# Altium project sensor_hub_project.PrjPCB
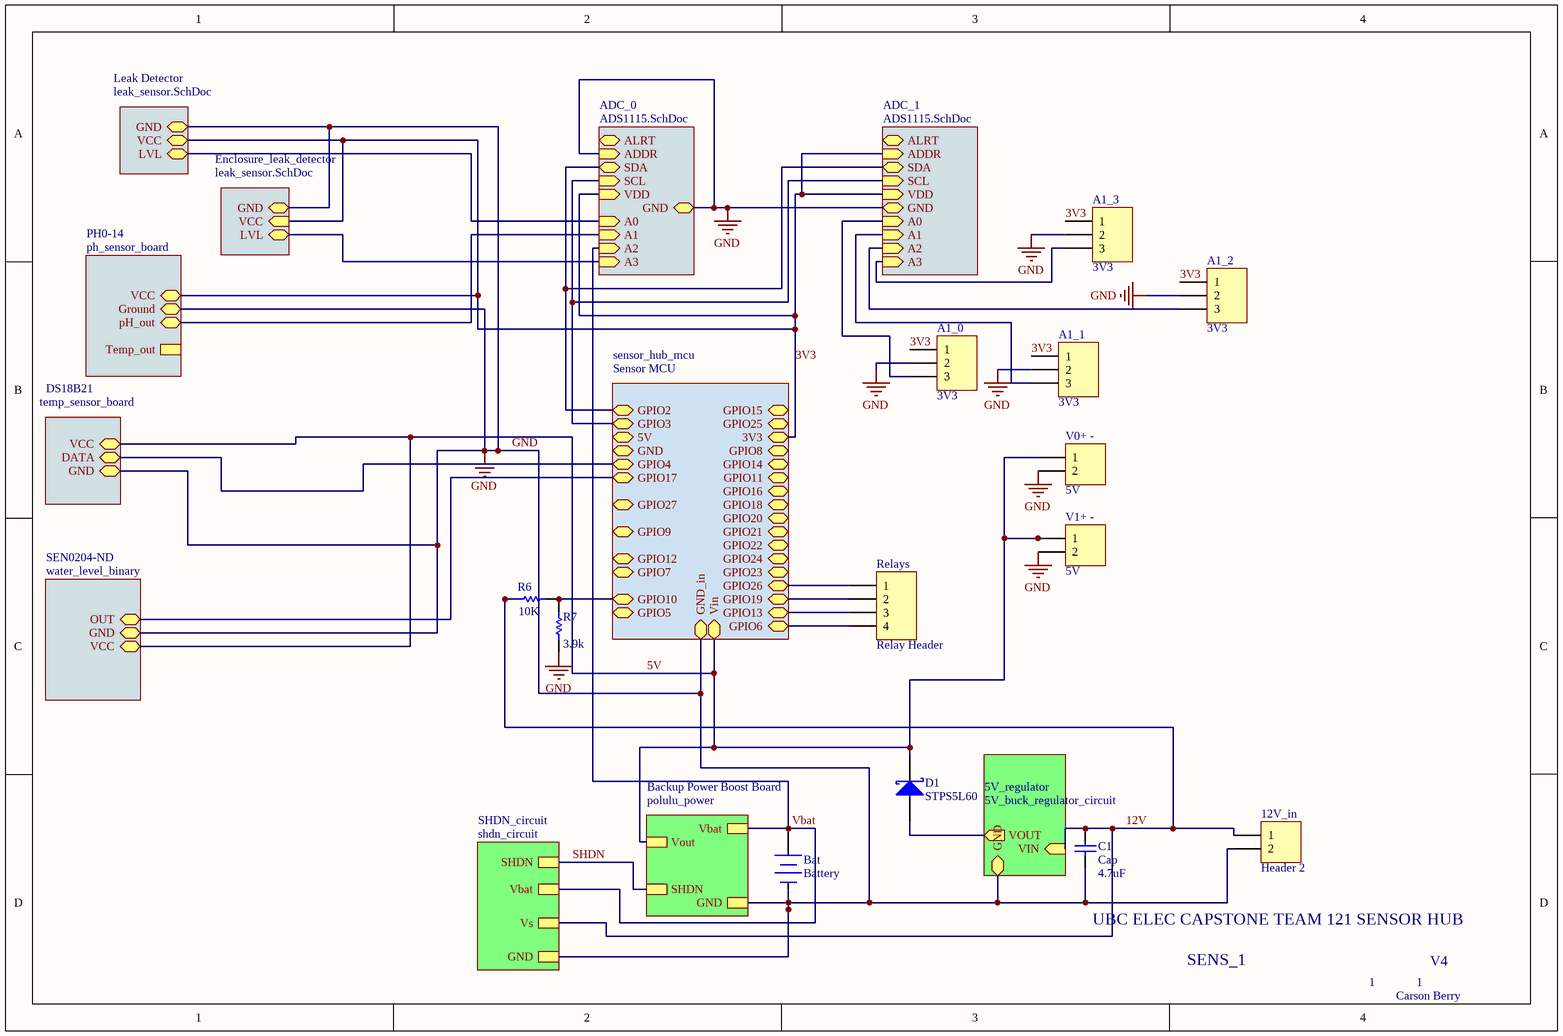
[diagram p0: water_quality_sensor_hub.SchDoc]
9 sheets, 30 parts. Net scope: hierarchical (ports join the sheet entries above them; power ports are global).
Board file: piponic_pcb_v2.PcbDoc
Sheets:
  water_quality_sensor_hub.SchDoc
    PH0-14 = ph_sensor_board.SchDoc
    DS18B21 = temp_sensor_board.SchDoc
    Sensor MCU = sensor_hub_mcu.SchDoc
    SEN0204-ND = water_level_binary.SchDoc
    Leak Detector = leak_sensor.SchDoc
    ADC_0 = ADS1115.SchDoc
    Backup Power Boost Board = polulu_power.SchDoc
    SHDN_circuit = shdn_circuit.SchDoc
    ADC_1 = ADS1115.SchDoc
    Enclosure_leak_detector = leak_sensor.SchDoc

## Sheet water_quality_sensor_hub.SchDoc
size A4

### Parts
12V_in  Header 2  [2_channel_terminal_block]
A1_0  3V3  [3_channel_terminal_block]
A1_1  3V3  [3_channel_terminal_block]
A1_2  3V3  [3_channel_terminal_block]
A1_3  3V3  [3_channel_terminal_block]
Bat  Battery  [BAT-2]
C1  Cap  value 4.7uF  [RAD-0.3]
D1  STPS5L60  [STM-DO-201AD]
R6  value 10K  [AXIAL-0.3]  (hidden comment: Res1)
R7  value 3.9k  [AXIAL-0.3]  (hidden comment: Res1)
Relays  Relay Header  [4_channel_terminal_block]
V0+_-  5V  [2_channel_terminal_block]
V1+_-  5V  [2_channel_terminal_block]

### Sub-sheets
5V_regulator = 5V_buck_regulator_circuit (file not in this document): VOUT (out), GND (bidir), VIN (in)
ADC_0 = ADS1115.SchDoc: A2 (in), ALRT (bidir), ADDR (in), SDA (bidir), SCL (in), A3 (in), GND (bidir), A0 (in), A1 (in), VDD (in)
ADC_1 = ADS1115.SchDoc: A2 (in), ALRT (bidir), ADDR (in), SDA (bidir), SCL (in), A3 (in), GND (bidir), A0 (in), A1 (in), VDD (in)
Backup Power Boost Board = polulu_power: SHDN, Vbat, Vout, GND
DS18B21 = temp_sensor_board: VCC (bidir), DATA (bidir), GND (bidir)
Enclosure_leak_detector = leak_sensor.SchDoc: GND (bidir), VCC (in), LVL (bidir)
Leak Detector = leak_sensor.SchDoc: GND (bidir), VCC (bidir), LVL (bidir)
PH0-14 = ph_sensor_board: VCC (bidir), Ground (bidir), pH_out (bidir), Temp_out
SEN0204-ND = water_level_binary: OUT (bidir), GND (bidir), VCC (bidir)
Sensor MCU = sensor_hub_mcu: GPIO2 (bidir), GPIO3 (bidir), GND (bidir), GPIO15 (bidir), GPIO17 (bidir), GPIO10 (bidir), GPIO8 (bidir), GPIO14 (bidir), GPIO11 (bidir), GPIO16 (bidir), GPIO18 (bidir), GPIO20 (bidir), GPIO21 (bidir), GPIO22 (bidir), GPIO24 (bidir), GPIO23 (bidir), GPIO25 (bidir), GPIO26 (bidir), 5V (bidir), GPIO19 (bidir), GPIO9 (bidir), GPIO13 (bidir), GPIO12 (bidir), GPIO7 (bidir), GPIO6 (bidir), GPIO4 (bidir), GPIO5 (bidir), 3V3 (bidir), GPIO27 (bidir), Vin (bidir), GND_in (bidir)
SHDN_circuit = shdn_circuit: GND, Vbat, Vs, SHDN

### Nets
GND: 12V_in.2 A1_0.2 A1_1.2 A1_2.2 A1_3.2 Bat.2(-) C1.1 R7.1 V0+_-.2 V1+_-.2 ; sheet PH0-14/Ground, sheet DS18B21/GND, sheet Sensor MCU/GND, sheet Sensor MCU/GND_in, sheet SEN0204-ND/GND, sheet Leak Detector/GND, sheet ADC_0/ADDR, sheet ADC_0/GND, sheet 5V_regulator/GND, sheet Backup Power Boost Board/GND, sheet SHDN_circuit/GND, sheet ADC_1/GND, sheet Enclosure_leak_detector/GND
3V3: A1_0.1 A1_1.1 A1_2.1 A1_3.1 ; sheet PH0-14/VCC, sheet Sensor MCU/3V3, sheet Leak Detector/VCC, sheet ADC_0/VDD, sheet ADC_1/ADDR, sheet ADC_1/VDD, sheet Enclosure_leak_detector/VCC
5V: D1.1(K) V0+_-.1 V1+_-.1 ; sheet DS18B21/VCC, sheet Sensor MCU/Vin, sheet SEN0204-ND/VCC, sheet Backup Power Boost Board/Vout
12V: 12V_in.1 C1.2 R6.1 ; sheet 5V_regulator/VIN, sheet SHDN_circuit/Vs
SHDN: sheet Backup Power Boost Board/SHDN, sheet SHDN_circuit/SHDN
Vbat: Bat.1(+) ; sheet ADC_0/A2, sheet Backup Power Boost Board/Vbat, sheet SHDN_circuit/Vbat
NetA1_0_3: A1_0.3 ; sheet ADC_1/A0
NetA1_1_3: A1_1.3 ; sheet ADC_1/A1
NetA1_2_3: A1_2.3 ; sheet ADC_1/A2
NetA1_3_3: A1_3.3 ; sheet ADC_1/A3
NetADC_0_3: sheet Sensor MCU/GPIO3, sheet ADC_0/SCL, sheet ADC_1/SCL
NetADC_0_4: sheet Sensor MCU/GPIO2, sheet ADC_0/SDA, sheet ADC_1/SDA
NetADC_0_7: sheet Leak Detector/LVL, sheet ADC_0/A0
NetADC_0_8: sheet PH0-14/pH_out, sheet ADC_0/A1
NetADC_0_10: sheet ADC_0/A3, sheet Enclosure_leak_detector/LVL
NetD1_2: D1.2(A) ; sheet 5V_regulator/VOUT
NetP12_7: sheet DS18B21/DATA, sheet Sensor MCU/GPIO4
NetP12_11: sheet Sensor MCU/GPIO17, sheet SEN0204-ND/OUT
NetP12_21: R6.2 R7.2 ; sheet Sensor MCU/GPIO10
NetP12_31: Relays.4 ; sheet Sensor MCU/GPIO6
NetP12_33: Relays.3 ; sheet Sensor MCU/GPIO13
NetP12_35: Relays.2 ; sheet Sensor MCU/GPIO19
NetP12_37: Relays.1 ; sheet Sensor MCU/GPIO26

### Notes on the sheet
- UBC ELEC CAPSTONE TEAM 121 SENSOR HUB
- SENS_1
- 1
- V4
- Carson Berry

### Library data of the parts
12V_in = Header 2: Power 12V in; LatestRevisionDate: 17-Jul-2002; LatestRevisionNote: Re-released for DXP Platform.; Publisher: Altium Limited
A1_0-A1_3 = Header 3: Header, 3-Pin; LatestRevisionDate: 17-Jul-2002; LatestRevisionNote: Re-released for DXP Platform.; Publisher: Altium Limited
Bat = Battery: 2AA batteries; Published: 24-Mar-1999; LatestRevisionDate: 17-Jul-2002; LatestRevisionNote: Re-released for DXP Platform.; PackageReference: BAT-2; Publisher: Altium Limited; PackageDescription: Battery; 2 Leads
C1 = Cap: Capacitor; Published: 8-Jun-2000; LatestRevisionDate: 17-Jul-2002; LatestRevisionNote: Re-released for DXP Platform.; PackageReference: RAD-0.3; Publisher: Altium Limited; PackageDescription: Radial Cap, Thru-Hole; 2 Leads; 0.3 in Pin Spacing
D1 = CMP-2000-05365-1: Power Schottky rectifier, 60 V, 5 A, 2-Pin DO-201AD, RoHS, Cut Tape; Manufacturer: STMicroelectronics; Other Related Documents: STPS5L60ViewAllSpecifications; Online Catalog: SchottkyDiode; Current - Average Rectified (Io): 5A; Speed: FastRecovery=200mA(Io); Current - Reverse Leakage @ Vr: 220µA@60V; Other Names: 497-12673-3STPS5L60-ND; Voltage - DC Reverse (Vr) (Max): 60V; Voltage - Forward (Vf) (Max) @ If: 520mV@5A; Package Description: 2-Pin Axial Lead, Dia 5.3 mm, Body Length 9.5 mm; Datasheet Version: Rev. 3, 05/2008; Datasheet URL: http://download.siliconexpert.com/pdfs/2012/8/10/13/5/5/781/st_/manual/cd00002924.pdf; Operating Temperature - Junction: 150degC(Max); Capacitance @ Vr, F: -; Manufacturer URL: http://www.st.com/; Standard Package: 600; Diode Type: Schottky; Package Reference: DO-201AD; Category: DiscreteSemiconductorProducts; Package / Case: DO-201AD,Axial; Family: Diodes,Rectifiers-Single; Packaging: Tape&Box(TB); Supplier Device Package: DO-201AD; Reverse Recovery Time (trr): -; Package URL: http://download.siliconexpert.com/pdfs/2012/8/10/13/5/5/781/st_/manual/cd00002924.pdf; Mounting Type: ThroughHole; Series: -
R6 R7 = Res1: Resistor; Published: 8-Jun-2000; LatestRevisionDate: 17-Jul-2002; LatestRevisionNote: Re-released for DXP Platform.; PackageReference: AXIAL-0.3; Publisher: Altium Limited; PackageDescription: Axial Device, Thru-Hole; 2 Leads; 0.3 in Pin Spacing
Relays = Header 4: Relay Control; LatestRevisionDate: 17-Jul-2002; LatestRevisionNote: Re-released for DXP Platform.; Publisher: Altium Limited
V0+_- V1+_- = Header 2: Header, 2-Pin; LatestRevisionDate: 17-Jul-2002; LatestRevisionNote: Re-released for DXP Platform.; Publisher: Altium Limited

## Sheet ph_sensor_board.SchDoc
size A4
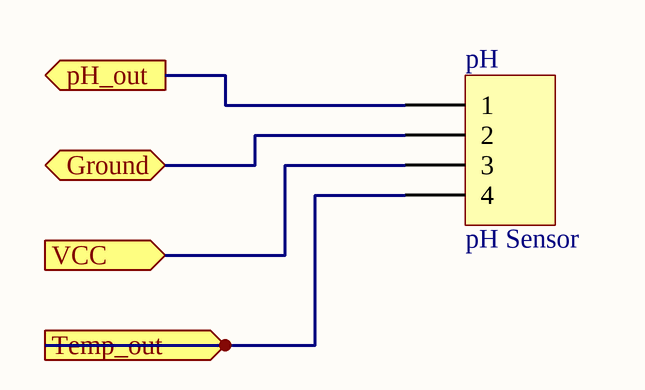
[diagram p1: ph_sensor_board.SchDoc]

### Parts
pH  pH Sensor  [4_channel_terminal_block]

### Ports
Ground (bidir), pH_out (out), Temp_out (out), VCC (in)

### Nets
GND: pH.2 ; port Ground
3V3: pH.3 ; port VCC
NetADC_0_8: pH.1 ; port pH_out
NetpH_4: pH.4 ; port Temp_out

### Library data of the parts
pH = Header 4: Header, 4-Pin; LatestRevisionDate: 17-Jul-2002; LatestRevisionNote: Re-released for DXP Platform.; Publisher: Altium Limited

## Sheet temp_sensor_board.SchDoc
size A4
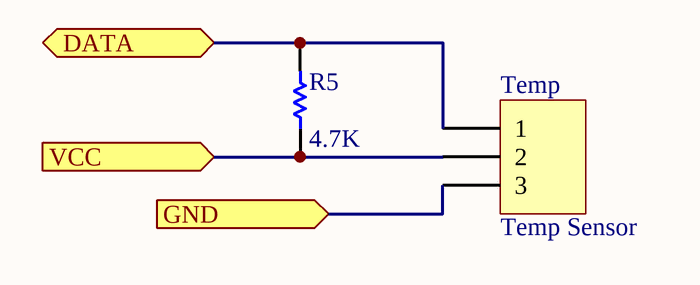
[diagram p2: temp_sensor_board.SchDoc]

### Parts
R5  value 4.7K  [AXIAL-0.3]
Temp  Temp Sensor  [HDR1X3]

### Ports
DATA (bidir), GND (in), VCC (in)

### Nets
GND: Temp.3 ; port GND
5V: R5.1 Temp.2 ; port VCC
NetP12_7: R5.2 Temp.1 ; port DATA

### Library data of the parts
R5 = Res1: Pull up; Published: 8-Jun-2000; LatestRevisionDate: 17-Jul-2002; LatestRevisionNote: Re-released for DXP Platform.; PackageReference: AXIAL-0.3; Publisher: Altium Limited; PackageDescription: Axial Device, Thru-Hole; 2 Leads; 0.3 in Pin Spacing
Temp = Header 3: Header, 3-Pin; LatestRevisionDate: 17-Jul-2002; LatestRevisionNote: Re-released for DXP Platform.; Publisher: Altium Limited

## Sheet sensor_hub_mcu.SchDoc
size A4
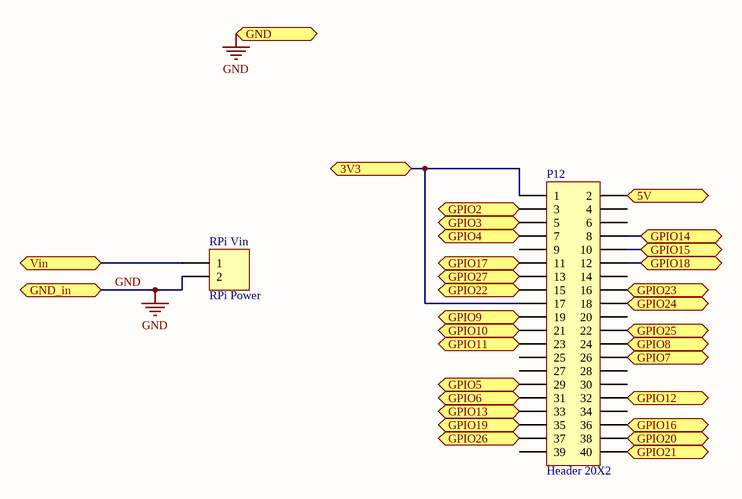
[diagram p3: sensor_hub_mcu.SchDoc]

### Parts
P12  Header 20X2  [HDR2X20]
RPi_Vin  RPi Power  [HDR1X2]

### Ports
3V3 (bidir), 5V (bidir), GND (bidir), GND_in (bidir), GPIO2 (bidir), GPIO3 (bidir), GPIO4 (bidir), GPIO5 (bidir), GPIO6 (bidir), GPIO7 (bidir), GPIO8 (bidir), GPIO9 (bidir), GPIO10 (bidir), GPIO11 (bidir), GPIO12 (bidir), GPIO13 (bidir), GPIO14 (bidir), GPIO15 (bidir), GPIO16 (bidir), GPIO17 (bidir), GPIO18 (bidir), GPIO19 (bidir), GPIO20 (bidir), GPIO21 (bidir), GPIO22 (bidir), GPIO23 (bidir), GPIO24 (bidir), GPIO25 (bidir), GPIO26 (bidir), GPIO27 (bidir), Vin (bidir)

### Nets
GND: RPi_Vin.2 ; port GND, port GND_in
3V3: P12.1 P12.17 ; port 3V3
5V: RPi_Vin.1 ; port Vin
NetADC_0_3: P12.5 ; port GPIO3
NetADC_0_4: P12.3 ; port GPIO2
NetP12_2: P12.2 ; port 5V
NetP12_7: P12.7 ; port GPIO4
NetP12_8: P12.8 ; port GPIO14
NetP12_10: P12.10 ; port GPIO15
NetP12_11: P12.11 ; port GPIO17
NetP12_12: P12.12 ; port GPIO18
NetP12_13: P12.13 ; port GPIO27
NetP12_15: P12.15 ; port GPIO22
NetP12_16: P12.16 ; port GPIO23
NetP12_18: P12.18 ; port GPIO24
NetP12_19: P12.19 ; port GPIO9
NetP12_21: P12.21 ; port GPIO10
NetP12_22: P12.22 ; port GPIO25
NetP12_23: P12.23 ; port GPIO11
NetP12_24: P12.24 ; port GPIO8
NetP12_26: P12.26 ; port GPIO7
NetP12_29: P12.29 ; port GPIO5
NetP12_31: P12.31 ; port GPIO6
NetP12_32: P12.32 ; port GPIO12
NetP12_33: P12.33 ; port GPIO13
NetP12_35: P12.35 ; port GPIO19
NetP12_36: P12.36 ; port GPIO16
NetP12_37: P12.37 ; port GPIO26
NetP12_38: P12.38 ; port GPIO20
NetP12_40: P12.40 ; port GPIO21

Not connected (* = marked no-connect by the designer): P12 4 6 9 14 20 25 27 28 30 34 39

### Library data of the parts
P12 = Header 20X2: GPIO shield for RPi; LatestRevisionDate: 17-Jul-2002; LatestRevisionNote: Re-released for DXP Platform.; Publisher: Altium Limited
RPi_Vin = Header 2: Power Pins; LatestRevisionDate: 17-Jul-2002; LatestRevisionNote: Re-released for DXP Platform.; Publisher: Altium Limited

## Sheet water_level_binary.SchDoc
size A4
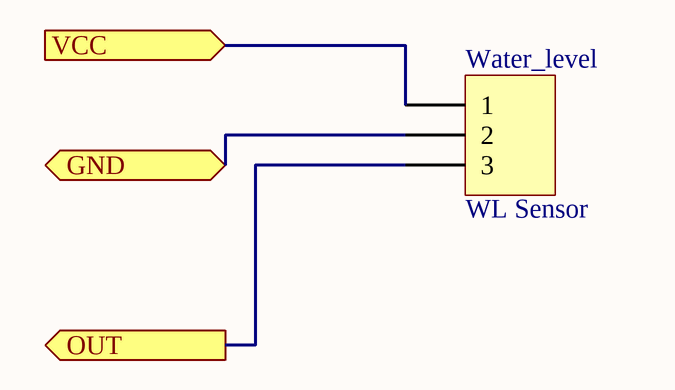
[diagram p4: water_level_binary.SchDoc]

### Parts
Water_level  WL Sensor  [3_channel_terminal_block]

### Ports
GND (bidir), OUT (out), VCC (in)

### Nets
GND: Water_level.2 ; port GND
5V: Water_level.1 ; port VCC
NetP12_11: Water_level.3 ; port OUT

### Library data of the parts
Water_level = Header 3: Header, 3-Pin; LatestRevisionDate: 17-Jul-2002; LatestRevisionNote: Re-released for DXP Platform.; Publisher: Altium Limited

## Sheet leak_sensor.SchDoc
size A4
Used 2 times, as channels Leak Detector, Enclosure_leak_detector. Parts and nets are listed once, with the designators drawn on the sheet.
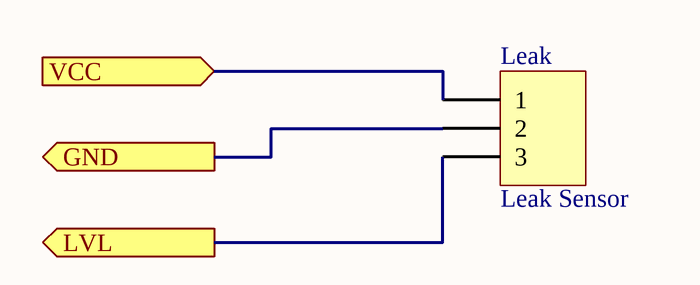
[diagram p5: leak_sensor.SchDoc]

### Parts
Leak  Leak Sensor  [3_channel_terminal_block]

### Ports
GND (out), LVL (out), VCC (in)

### Nets
GND: Leak.2 ; port GND
LVL: Leak.3 ; port LVL
VCC: Leak.1 ; port VCC

### Channels
Leak Detector: ports GND=GND LVL=NetADC_0_7 VCC=3V3
Enclosure_leak_detector: designators Leak=Encl_leak; ports GND=GND LVL=NetADC_0_10 VCC=3V3

### Library data of the parts
Leak = Header 3: Header, 3-Pin; LatestRevisionDate: 17-Jul-2002; LatestRevisionNote: Re-released for DXP Platform.; Publisher: Altium Limited

## Sheet ADS1115.SchDoc
size A4
Used 2 times, as channels ADC_0, ADC_1. Parts and nets are listed once, with the designators drawn on the sheet.
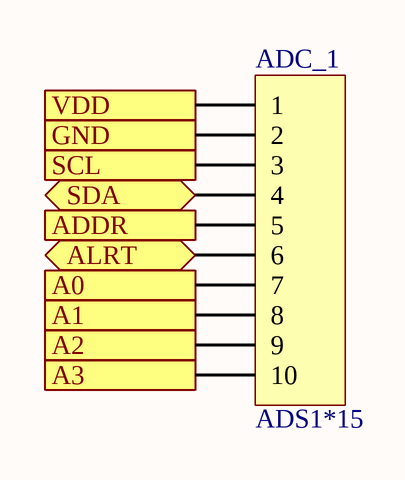
[diagram p6: ADS1115.SchDoc]

### Parts
ADC_1  ADS1*15  [HDR1X10]

### Ports
A0 (in), A1 (in), A2 (in), A3 (in), ADDR (in), ALRT (bidir), GND (out), SCL (in), SDA (bidir), VDD (in)

### Nets
A0: ADC_1.7 ; port A0
A1: ADC_1.8 ; port A1
A2: ADC_1.9 ; port A2
A3: ADC_1.10 ; port A3
ADDR: ADC_1.5 ; port ADDR
ALRT: ADC_1.6 ; port ALRT
GND: ADC_1.2 ; port GND
SCL: ADC_1.3 ; port SCL
SDA: ADC_1.4 ; port SDA
VDD: ADC_1.1 ; port VDD

### Channels
ADC_0: designators ADC_1=ADC_0; ports A0=NetADC_0_7 A1=NetADC_0_8 A2=Vbat A3=NetADC_0_10 ADDR=GND ALRT=NetADC_0_6 GND=GND SCL=NetADC_0_3 SDA=NetADC_0_4 VDD=3V3
ADC_1: ports A0=NetA1_0_3 A1=NetA1_1_3 A2=NetA1_2_3 A3=NetA1_3_3 ADDR=3V3 ALRT=NetADC_1_6 GND=GND SCL=NetADC_0_3 SDA=NetADC_0_4 VDD=3V3

### Library data of the parts
ADC_1 = Header 10: Header, 10-Pin; LatestRevisionDate: 17-Jul-2002; LatestRevisionNote: Re-released for DXP Platform.; Publisher: Altium Limited

## Sheet polulu_power.SchDoc
size A4
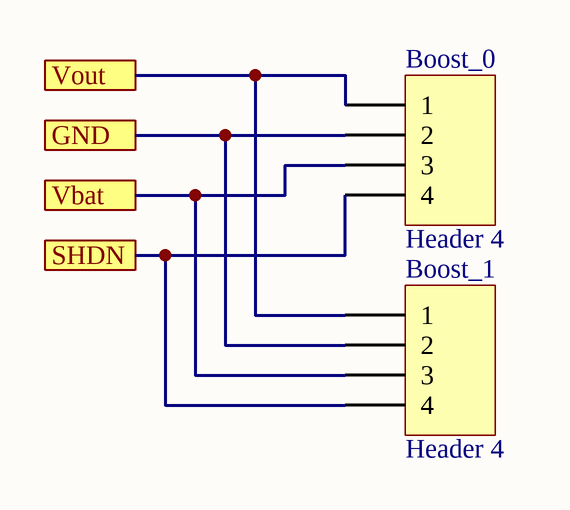
[diagram p7: polulu_power.SchDoc]

### Parts
Boost_0  Header 4  [HDR1X4]
Boost_1  Header 4  [HDR1X4]

### Ports
GND, SHDN, Vbat, Vout

### Nets
GND: Boost_0.2 Boost_1.2 ; port GND
5V: Boost_0.1 Boost_1.1 ; port Vout
SHDN: Boost_0.4 Boost_1.4 ; port SHDN
Vbat: Boost_0.3 Boost_1.3 ; port Vbat

### Library data of the parts
Boost_0 Boost_1 = Header 4: Header, 4-Pin; LatestRevisionDate: 17-Jul-2002; LatestRevisionNote: Re-released for DXP Platform.; Publisher: Altium Limited

## Sheet shdn_circuit.SchDoc
size A4
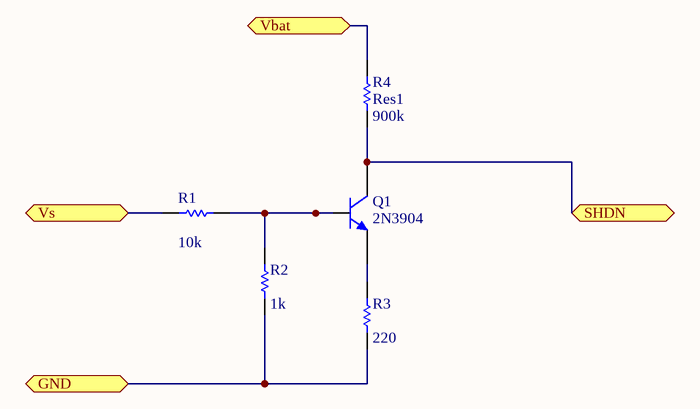
[diagram p8: shdn_circuit.SchDoc]

### Parts
Q1  2N3904  [TO-92A]
R1  value 10k  [AXIAL-0.3]  (hidden comment: Res1)
R2  value 1k  [AXIAL-0.3]  (hidden comment: Res1)
R3  value 220  [AXIAL-0.3]  (hidden comment: Res1)
R4  Res1  value 900k  [AXIAL-0.3]

### Ports
GND (bidir), SHDN (bidir), Vbat (bidir), Vs (bidir)

### Nets
GND: R2.1 R3.1 ; port GND
12V: R1.1 ; port Vs
SHDN: Q1.3(C) R4.2 ; port SHDN
Vbat: R4.1 ; port Vbat
NetQ1_1: Q1.1(E) R3.2
NetQ1_2: Q1.2(B) R1.2 R2.2

### Library data of the parts
Q1 = 2N3904: NPN General Purpose Amplifier; Published: 8-Jun-2000; LatestRevisionDate: 15-Jan-2003; LatestRevisionNote: PCB Footprint 'BCY-W3/D4.7' replaced; DatasheetVersion: 1997; PackageVersion: Sep-1998; PackageReference: TO-92A; Publisher: Altium Limited; PackageDescription: TO, Flat Index; 3 In-Line, Axial Leads; Body Dia. 4.5mm; Leads 0.51 x 0.48 mm (max); ComponentLink1Description: Manufacturer Link; ComponentLink1URL: http://www.fairchildsemi.com/; ComponentLink2Description: Datasheet; ComponentLink2URL: http://www.fairchildsemi.com/ds/2N%2F2N3904.pdf
R1-R4 = Res1: Resistor; Published: 8-Jun-2000; LatestRevisionDate: 17-Jul-2002; LatestRevisionNote: Re-released for DXP Platform.; PackageReference: AXIAL-0.3; Publisher: Altium Limited; PackageDescription: Axial Device, Thru-Hole; 2 Leads; 0.3 in Pin Spacing

## Nets that join several sheets
GND: water_quality_sensor_hub (10 pins), ph_sensor_board (pH.2), temp_sensor_board (Temp.3), sensor_hub_mcu (RPi_Vin.2), water_level_binary (Water_level.2), Leak Detector (Leak.2), ADC_0 (ADC_0.2 ADC_0.5), polulu_power (Boost_0.2 Boost_1.2), shdn_circuit (R2.1 R3.1), ADC_1 (ADC_1.2), Enclosure_leak_detector (Encl_leak.2)
3V3: water_quality_sensor_hub (A1_0.1 A1_1.1 A1_2.1 A1_3.1), ph_sensor_board (pH.3), sensor_hub_mcu (P12.1 P12.17), Leak Detector (Leak.1), ADC_0 (ADC_0.1), ADC_1 (ADC_1.1 ADC_1.5), Enclosure_leak_detector (Encl_leak.1)
5V: water_quality_sensor_hub (D1.1 V0+_-.1 V1+_-.1), temp_sensor_board (R5.1 Temp.2), sensor_hub_mcu (RPi_Vin.1), water_level_binary (Water_level.1), polulu_power (Boost_0.1 Boost_1.1)
12V: water_quality_sensor_hub (12V_in.1 C1.2 R6.1), shdn_circuit (R1.1)
NetA1_0_3: water_quality_sensor_hub (A1_0.3), ADC_1 (ADC_1.7)
NetA1_1_3: water_quality_sensor_hub (A1_1.3), ADC_1 (ADC_1.8)
NetA1_2_3: water_quality_sensor_hub (A1_2.3), ADC_1 (ADC_1.9)
NetA1_3_3: water_quality_sensor_hub (A1_3.3), ADC_1 (ADC_1.10)
NetADC_0_3: sensor_hub_mcu (P12.5), ADC_0 (ADC_0.3), ADC_1 (ADC_1.3)
NetADC_0_4: sensor_hub_mcu (P12.3), ADC_0 (ADC_0.4), ADC_1 (ADC_1.4)
NetADC_0_7: Leak Detector (Leak.3), ADC_0 (ADC_0.7)
NetADC_0_8: ph_sensor_board (pH.1), ADC_0 (ADC_0.8)
NetADC_0_10: ADC_0 (ADC_0.10), Enclosure_leak_detector (Encl_leak.3)
NetP12_7: temp_sensor_board (R5.2 Temp.1), sensor_hub_mcu (P12.7)
NetP12_11: sensor_hub_mcu (P12.11), water_level_binary (Water_level.3)
NetP12_21: water_quality_sensor_hub (R6.2 R7.2), sensor_hub_mcu (P12.21)
NetP12_31: water_quality_sensor_hub (Relays.4), sensor_hub_mcu (P12.31)
NetP12_33: water_quality_sensor_hub (Relays.3), sensor_hub_mcu (P12.33)
NetP12_35: water_quality_sensor_hub (Relays.2), sensor_hub_mcu (P12.35)
NetP12_37: water_quality_sensor_hub (Relays.1), sensor_hub_mcu (P12.37)
SHDN: polulu_power (Boost_0.4 Boost_1.4), shdn_circuit (Q1.3 R4.2)
Vbat: water_quality_sensor_hub (Bat.1), ADC_0 (ADC_0.9), polulu_power (Boost_0.3 Boost_1.3), shdn_circuit (R4.1)